# EAGLE design StartLine (EAGLE 9.6.2)
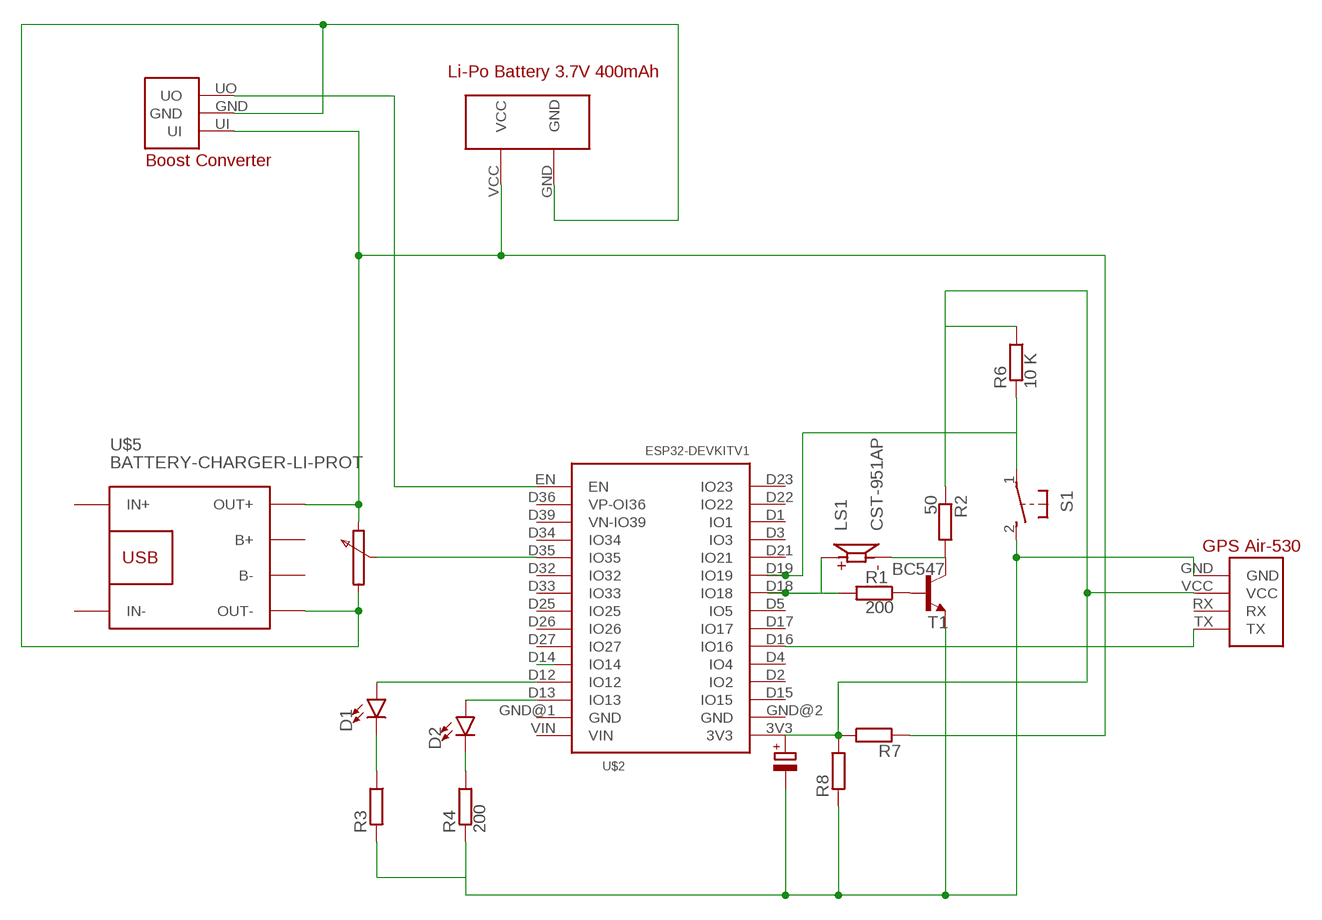
[diagram p0: schematic, sheet 1]

## Parts
D1  LED5MM  [LED_5MM]
D2  LED5MM  [LED_5MM]
LS1  CST-951AP  [CUI_CST-951AP]
R1  200  SMT-REF  [SMT-REF]
R2  50  SMT-REF  [SMT-REF]
R3  SMT-REF  [SMT-REF]
R4  200  SMT-REF  [SMT-REF]
R6  10 K  SMT-REF  [SMT-REF]
R7  SMT-REF  [SMT-REF]
R8  SMT-REF  [SMT-REF]
S1  31-XX  [B3F-31XX]
T1  BC547  [TO92]
U$1  BOOST_CONVERTER  [BOOST_CONVERTER]
U$2  ESP32DEVKITV1  [ESP32-DEVKITV1]
U$3  GPS  [GPS]
U$4  LIPO_BAT  [LIPO_BAT]
U$5  BATTERY-CHARGER-LI-PROT  [BATTERY-CHARGER-LI-PROT]

## Nets
N$1: R1.1 T1.2(B)
N$2: R3.2 R4.2 R8.2 S1.2(S) T1.1(E) U$3.GND
N$3: LS1.M R2.1 T1.3(C)
N$4: R1.2 U$2.D18(IO18)
N$5: R2.2 R6.1 R7.1 R8.1 U$2.3V3 U$3.VCC
N$6: R6.2 S1.1(P)
N$7: U$1.UO U$2.EN
N$8: D2.A U$2.D13(IO13)
N$9: D2.K(C) R4.1
N$10: U$2.D16(IO16) U$3.TX
N$11: U$2.D14(IO14)
N$12: D1.K(C) R3.1
N$13: R7.2 U$1.UI U$4.VCC U$5.OUT+
N$17: LS1.P
N$18: D1.A U$2.D12(IO12)
N$19: U$2.D19(IO19)
N$21: U$2.D35(IO35)
N$23: U$1.GND U$4.GND U$5.OUT-
Unconnected: U$2.D1(IO1) U$2.D2(IO2) U$2.D3(IO3) U$2.D4(IO4) U$2.D5(IO5) U$2.D15(IO15) U$2.D17(IO17) U$2.D21(IO21) U$2.D22(IO22) U$2.D23(IO23) U$2.D25(IO25) U$2.D26(IO26) U$2.D27(IO27) U$2.D32(IO32) U$2.D33(IO33) U$2.D34(IO34) U$2.D36(VP-OI36) U$2.D39(VN-IO39) U$2.GND@1(GND) U$2.GND@2(GND) U$2.VIN U$3.RX U$5.B+ U$5.B- U$5.IN+ U$5.IN-

## Library data of the parts
D1 D2 = SparkFun-LED:LED: LED (Generic) Standard schematic elements and footprints for 5mm, 3mm, 1206, and 0603 sized LEDs. Generic LEDs with no color specified.
LS1 = CST-951AP:CST-951AP: 9 mm, 5 V, 85 dB, Through Hole, Magnetic Audio Transducer Buzzer Check prices <https://pricing.snapeda.com/parts/CST-951AP/CUI%20Devices/view-part?ref=eda>; AVAILABILITY: In Stock; CUI_PURCHASE_URL: https://www.cuidevices.com/product/audio/buzzers/audio-transducers/cst-951ap?utm_source=snapeda.com&utm_medium=referral&utm_campaign=snapedaBOM; DESCRIPTION: 9 mm, 5 V, 85 dB, Through Hole, Magnetic Audio Transducer Buzzer; MF: CUI Devices; MP: CST-951AP; PACKAGE: CUI Inc.; PRICE: None; PURCHASE-URL: https://pricing.snapeda.com/search/part/CST-951AP/?ref=eda
R1-R4 R6-R8 = resistor-shunt:SMT-REF: SMD SHUNT RESISTOR; OC_FARNELL: unknown; OC_NEWARK: unknown
S1 = switch-omron:31-XX: OMRON SWITCH; MPN: B3F-3100; OC_FARNELL: 959704; OC_NEWARK: 36M3582
T1 = transistor:BC547: NPN TRANSISTOR
U$1 = ESP32:BOOST_CONVERTER
U$2 = ESP32-DEVKITV1:ESP32DEVKITV1
U$3 = ESP32:GPS
U$4 = ESP32:LIPO_BAT
U$5 = diy-modules:BATTERY-CHARGER-LI-PROT: Lithium Battery 5V Charger with protection circuit More details available here: http://www.instructables.com/id/DIY-Lithium-ion-Battery-Charger/step4/TP4056-based-lithium-ion-battery-charger-module/ Click here to find device on ebay.com <http://www.ebay.com/sch/tp4056+charger+usb+protection>

## Board
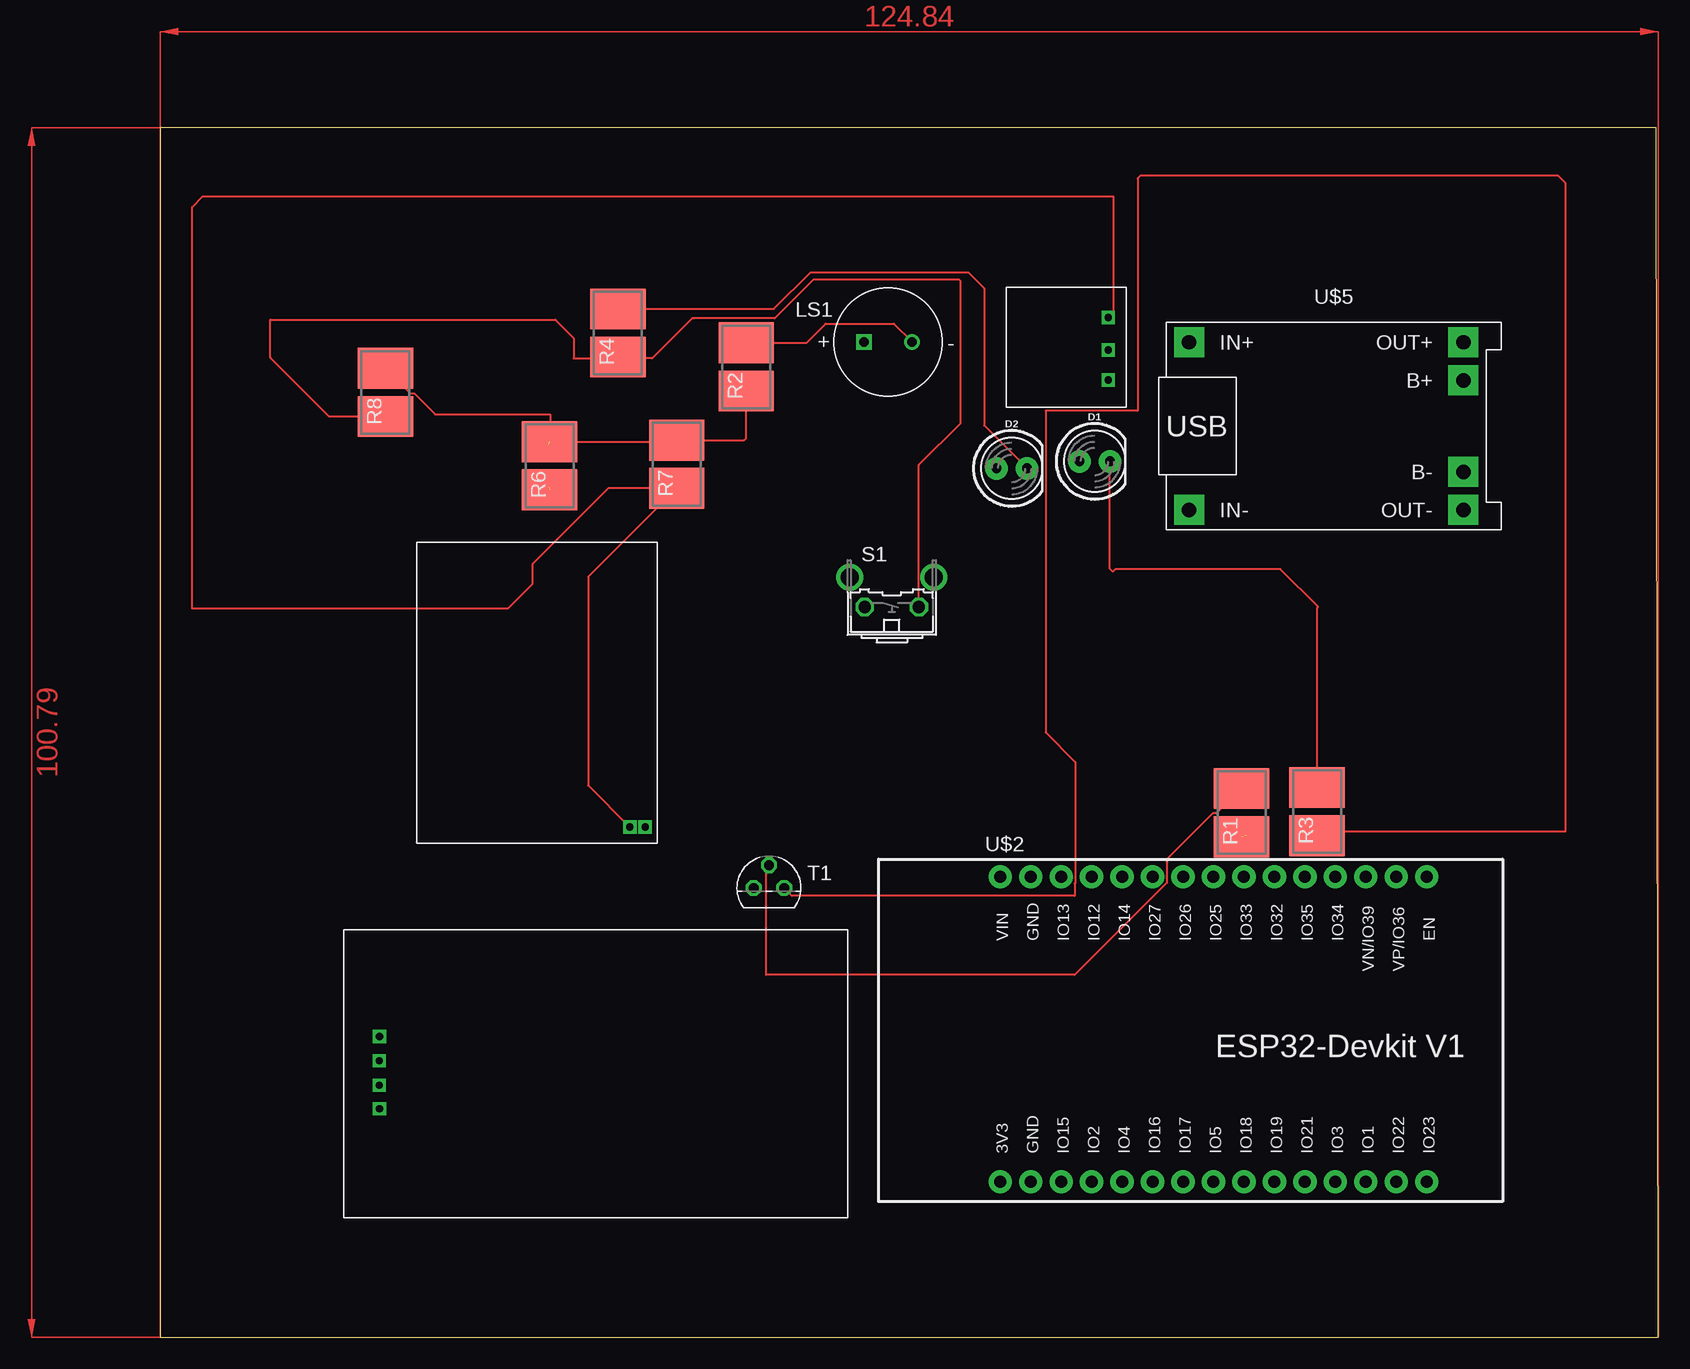
[diagram p1: board, top side]
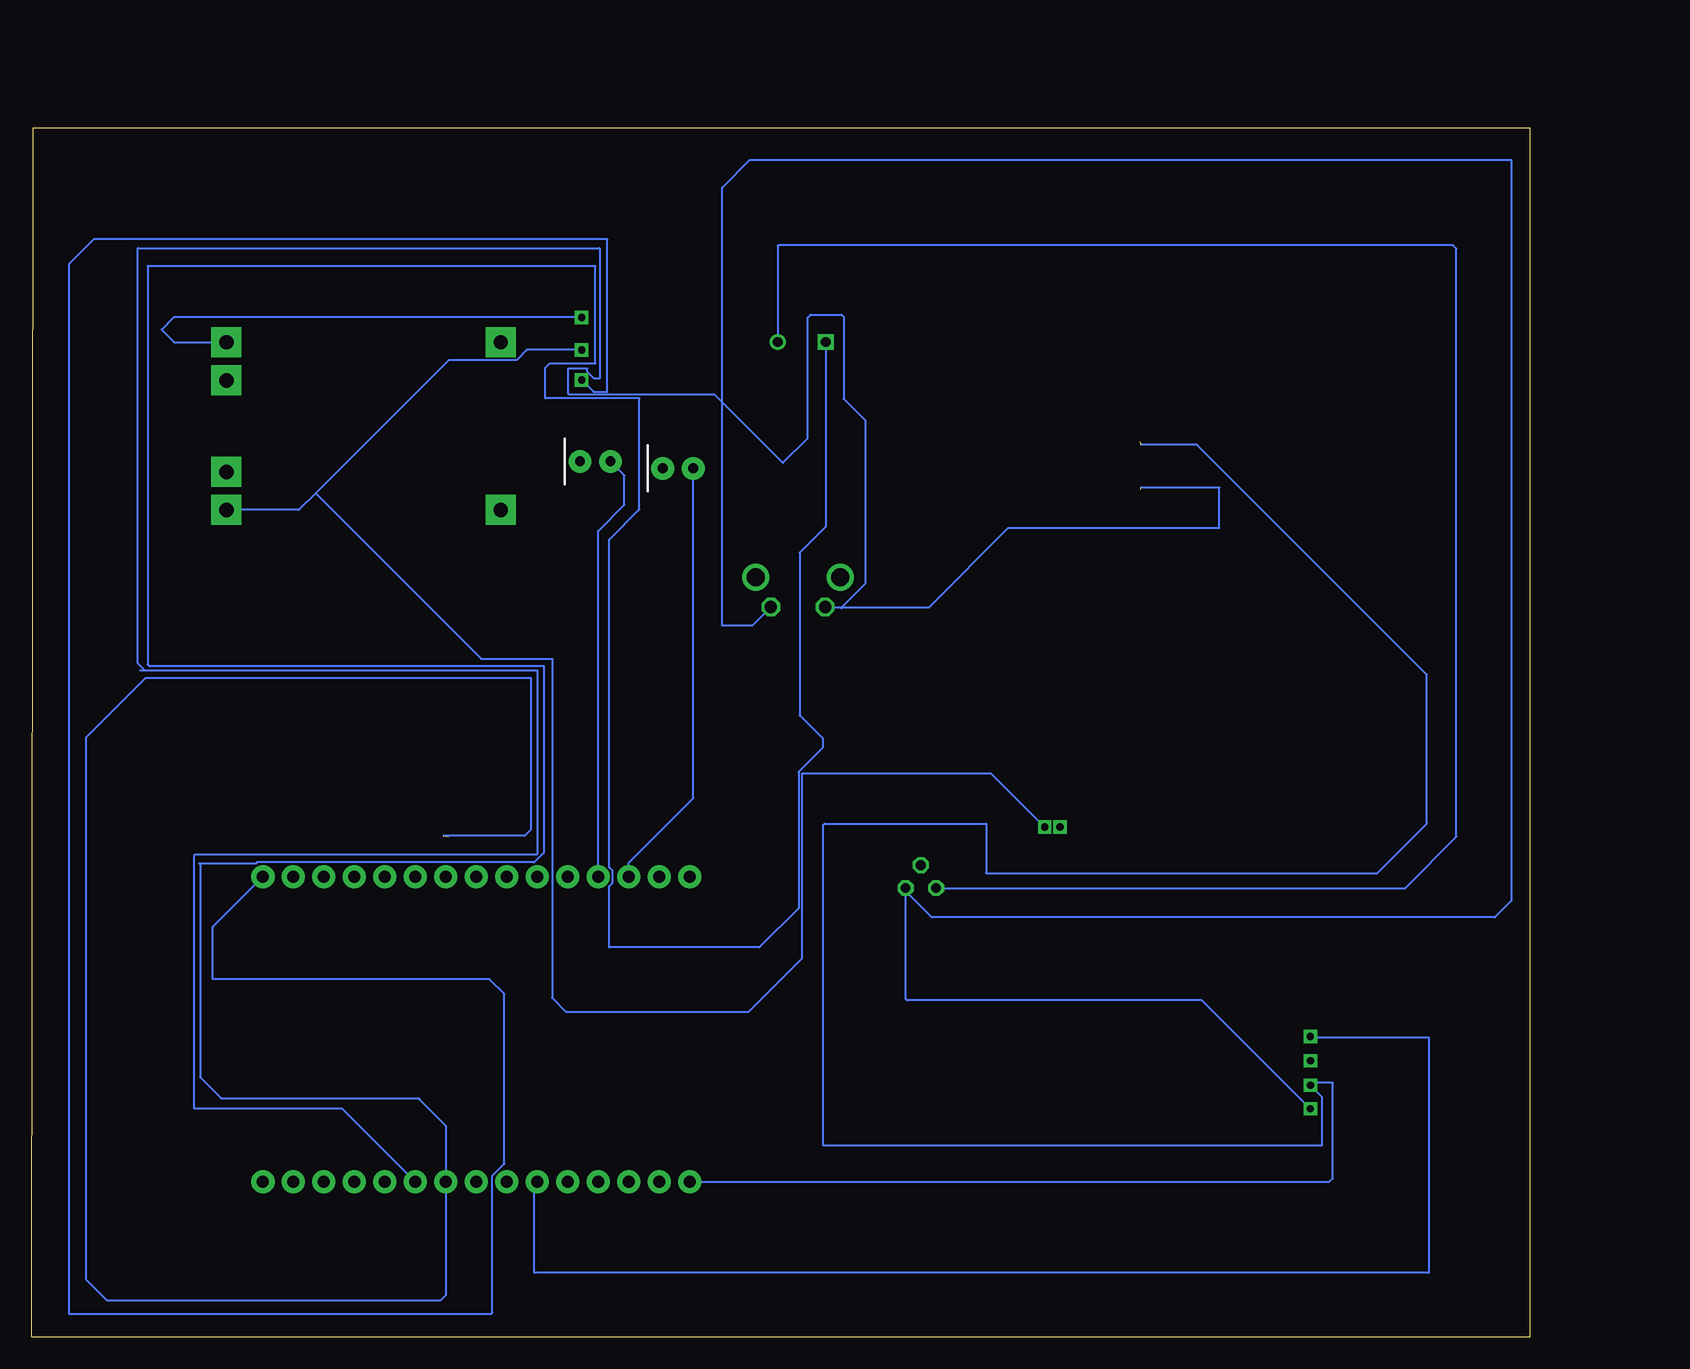
[diagram p2: board, bottom side, seen from below]

Size 124.84 x 100.79 mm. Coordinates in mm from the lower left corner, seen from the top.
Outline: 0,0 124.84,0 124.69,100.79 0,100.79 0,0
Copper layers (1*16): Top 0.035mm / dielectric 1.5mm / Bottom 0.035mm
Design rules "default": minimum track width 6mil, minimum drill 0.35mm, track to track 6mil, track to pad 6mil, pad to pad 6mil, via to via 6mil, smd to smd 6mil, copper to edge 40mil, drill to drill 6mil, minimum pad ring 10mil, minimum via ring 8mil, stop-mask expansion 4mil, vias tented up to drill 0mil, thermal gap 10mil

### Footprints (pad centres in the part's own frame; a part is rotated, then mirrored left to right if it is on the bottom)
LED_5MM = drill 0.813 pad 1.88: A -1.27,0; K 1.27,0
CUI_CST-951AP = drill 0.8: M 2,0 | drill 0.8 square: P -2,0
SMT-REF = smd 3.4 x 4.6: 1 2.007,0; 2 -2.007,0
B3F-31XX = drill 1.016 octagon: 1 -2.261,-1.245; 2 2.261,-1.245 | drill 1.499 pad 2.159: 3 -3.505,1.245; 4 3.505,1.245
TO92 = drill 0.813 octagon: 1 1.27,0; 2 0,1.905; 3 -1.27,0
BOOST_CONVERTER = drill 0.6 square: GND 8.504,4.774; UI 8.504,7.484; UO 8.504,2.28
ESP32-DEVKITV1 = drill 1 pad 1.93: 3V3 -16.52,-12.27; D1 13.96,-12.27; D2 -8.9,-12.27; D3 11.42,-12.27; D4 -6.36,-12.27; D5 1.26,-12.27; D12 -8.9,13.135; D13 -11.44,13.135; D14 -6.36,13.135; D15 -11.44,-12.27; D16 -3.82,-12.27; D17 -1.28,-12.27; D18 3.8,-12.27; D19 6.34,-12.27; D21 8.88,-12.27; D22 16.5,-12.27; D23 19.04,-12.27; D25 1.26,13.135; D26 -1.28,13.135; D27 -3.82,13.135; D32 6.34,13.135; D33 3.8,13.135; D34 11.42,13.135; D35 8.88,13.135; D36 16.5,13.135; D39 13.96,13.135; EN 19.04,13.135; GND@1 -13.98,13.135; GND@2 -13.98,-12.27; VIN -16.52,13.135
GPS = drill 0.6 square: GND 2.988,9.073; RX 2.973,13.084; TX 2.988,15.1; VCC 2.98,11.034
LIPO_BAT = drill 0.6 square: GND 19.05,1.27; VCC 17.78,1.27
BATTERY-CHARGER-LI-PROT = drill 1.2 pad 2.5 square: B+ 10.795,3.81; B- 10.795,-3.81; IN+ -12.065,6.985; IN- -12.065,-6.985; OUT+ 10.795,6.985; OUT- 10.795,-6.985

### Placement (x,y rotation side)
D1  77.87,73 0 top
D2  70.97,72.42 0 top
LS1  60.66,82.95 0 top
R1  90.11,43.74 90 top
R2  48.84,80.87 90 top
R3  96.4,43.82 90 top
R4  38.14,83.7 90 top
R6  32.45,72.64 90 top
R7  43.04,72.76 90 top
R8  18.77,78.74 90 top
S1  60.97,62.11 0 top
T1  50.73,37.45 0 top
U$1  70.49,77.51 0 top
U$2  86.52,25.25 0 top
U$3  15.28,9.97 0 top
U$4  21.36,41.26 0 top
U$5  97.8,75.94 0 top

### Tracks (layer width: path | path; a pad name or v marks a point on that pad's centre or on a via)
N$1
  Top 0.152: R1.1 88.03,43.66 87.72,43.66 83.89,39.83 83.89,37.89 76.21,30.21 50.49,30.21 50.49,39.12 T1.2
N$2
  Top 0.152: R8.2 14.09,76.74 9.18,81.64 9.18,84.81 32.92,84.81 34.46,83.28 34.46,81.59 37.73,81.59 38.05,81.59 | 38.05,81.59 R4.2 | R3.2 96.77,42.17 117.11,42.17 117.11,96.2 116.5,96.8 81.67,96.8 81.45,96.58 81.45,77.2 73.79,77.2 73.79,50.41 76.27,47.93 76.27,37.89 76.2,37.81 76.2,36.8 52.65,36.8 T1.1 | S1.2 63.23,72.71 66.7,76.18 66.7,88.02 66.58,88.14 54.44,88.14 51.21,84.91 44.44,84.91 44.38,84.97 41,81.59 38.05,81.59
  Bottom 0.152: U$3.GND 27.3,28.08 51.87,28.08 52,28.21 52,37.19 | 52,37.19 T1.1 | S1.2 64.77,59.32 67.29,59.32 67.29,95.81 64.97,98.13 1.52,98.13 1.52,36.37 2.89,35 49.8,35 52,37.19
N$3
  Top 0.152: R2.1 53.86,82.87 55.46,84.48 61.14,84.48 LS1.M
  Bottom 0.152: T1.3 10.38,37.45 6.1,41.73 6.1,90.73 6.39,91.02 62.6,91.02 62.66,90.96 LS1.M
N$4  (1 unrouted)
  Bottom 0.152: U$2.D18 90.32,3.52 90.78,3.05 118.52,3.05 120.26,4.8 120.26,50.02 115.32,54.96 83.23,54.96 83.23,42.31 83.75,41.79 90.53,41.79
N$5  (1 unrouted)
  Top 0.152: R8.1 20.86,78.67 21.17,78.67 22.92,76.92 32.49,76.92 32.49,74.69 R6.1 42.92,74.65 R7.1 48.67,74.77 48.84,74.94 R2.2
  Bottom 0.152: U$2.3V3 16.68,12.98 16.4,13.26 16.4,21.21 18.06,21.21 U$3.VCC 17.3,20.05 17.3,15.98 58.85,15.98 58.85,42.71 58.75,42.81 45.3,42.81 45.3,38.68 12.69,38.68 8.56,42.81 8.56,55.23 27.73,74.4 32.38,74.4
N$6  (1 unrouted)
  Bottom 0.152: S1.1 50.03,60.86 43.43,67.46 25.85,67.46 25.85,70.81 32.39,70.81
N$7
  Bottom 0.152: U$1.UO 78,78.79 76.85,78.79 76.85,91.51 119.66,91.51 121.73,89.44 121.73,1.98 86.5,1.98 86.43,2.05 86.43,13.47 85.44,14.46 85.44,28.62 86.68,29.86 109.72,29.86 109.72,34.22 U$2.EN
N$8
  Bottom 0.152: U$2.D13 75.08,39.55 69.7,44.93 D2.A
N$9
  Top 0.152: R4.1 51.15,85.7 54.21,88.76 67.32,88.76 68.67,87.41 68.67,75.99 D2.K
N$10
  Bottom 0.152: U$3.TX 18.2,25.01 8.42,25.01 8.42,5.38 82.94,5.38 82.94,12.74 U$2.D16
N$12
  Top 0.152: R3.1 96.4,60.78 96.5,60.88 93.36,64.03 79.6,64.03 79.38,63.81 79.14,64.05 D1.K
N$13
  Top 0.152: U$4.VCC 35.67,46 35.67,63.38 R7.2 37.33,70.75 31.01,64.43 31.01,62.77 28.97,60.74 2.67,60.74 2.67,94.19 3.56,95.08 79.43,95.08 79.43,85.42 U$1.UI
  Bottom 0.152: U$1.UI 113,84.99 114.01,83.98 112.95,82.93 U$5.OUT+
N$17
  Bottom 0.152: LS1.P 58.66,67.56 60.83,65.39 60.83,51.84 58.9,49.91 58.9,49.15 60.92,47.13 60.92,35.78 64.19,32.51 76.72,32.51 76.72,37.59 76.42,37.89 76.42,38.88 76.72,39.17 76.72,66.48 74.19,69.01 74.19,78.26 82.03,78.26 82.03,80.79 81.65,81.17 77.85,81.17 77.85,89.28 115.17,89.28 115.17,56.09 115.04,55.96 82.15,55.96 82.15,40.38 82.96,39.57 106.05,39.57 106.14,39.49 110.79,39.49 | 110.79,39.49 110.87,39.49 | 110.79,39.49 110.79,21.68 109.03,19.92 92.61,19.92 | 92.61,19.92 92.52,19.92 | 92.61,19.92 90.33,17.64 90.33,13.15
N$18
  Bottom 0.152: U$2.D12 77.62,67.19 75.43,69.38 75.43,71.83 D1.A
N$19
  Bottom 0.152: U$2.D19 98.95,19.07 111.27,19.07 111.27,40.18 111.21,40.25 82.73,40.25 82.67,40.31 82.67,55.56 115.37,55.56 | 115.37,55.56 115.79,55.56 | 115.37,55.56 115.98,56.17 115.98,90.78 77.5,90.78 77.5,79.9 77.95,79.9 78.51,80.46 78.51,80.71 80.14,80.71 80.14,78.68 80.04,78.58 67.95,78.58 62.24,72.87 60.16,74.95 60.16,84.98 59.91,85.24 57.33,85.24 57.16,85.07 57.16,78.21 55.38,76.43 55.38,62.79 57.33,60.84 57.33,60.76
N$23
  Bottom 0.152: U$1.GND 83.56,82.28 84.39,81.45 90.06,81.45 101.17,70.34 | U$5.OUT- 102.55,68.96 101.17,70.34 | 101.17,70.34 87.36,56.54 81.46,56.54 81.46,28.3 80.31,27.15 65.07,27.15 60.62,31.6 60.62,47 44.89,47 U$4.GND
(copper drawn outside any net)
  shapes: Top area x2